# Altium schematic sheet SEP00755AG.SCHDOC
size A4
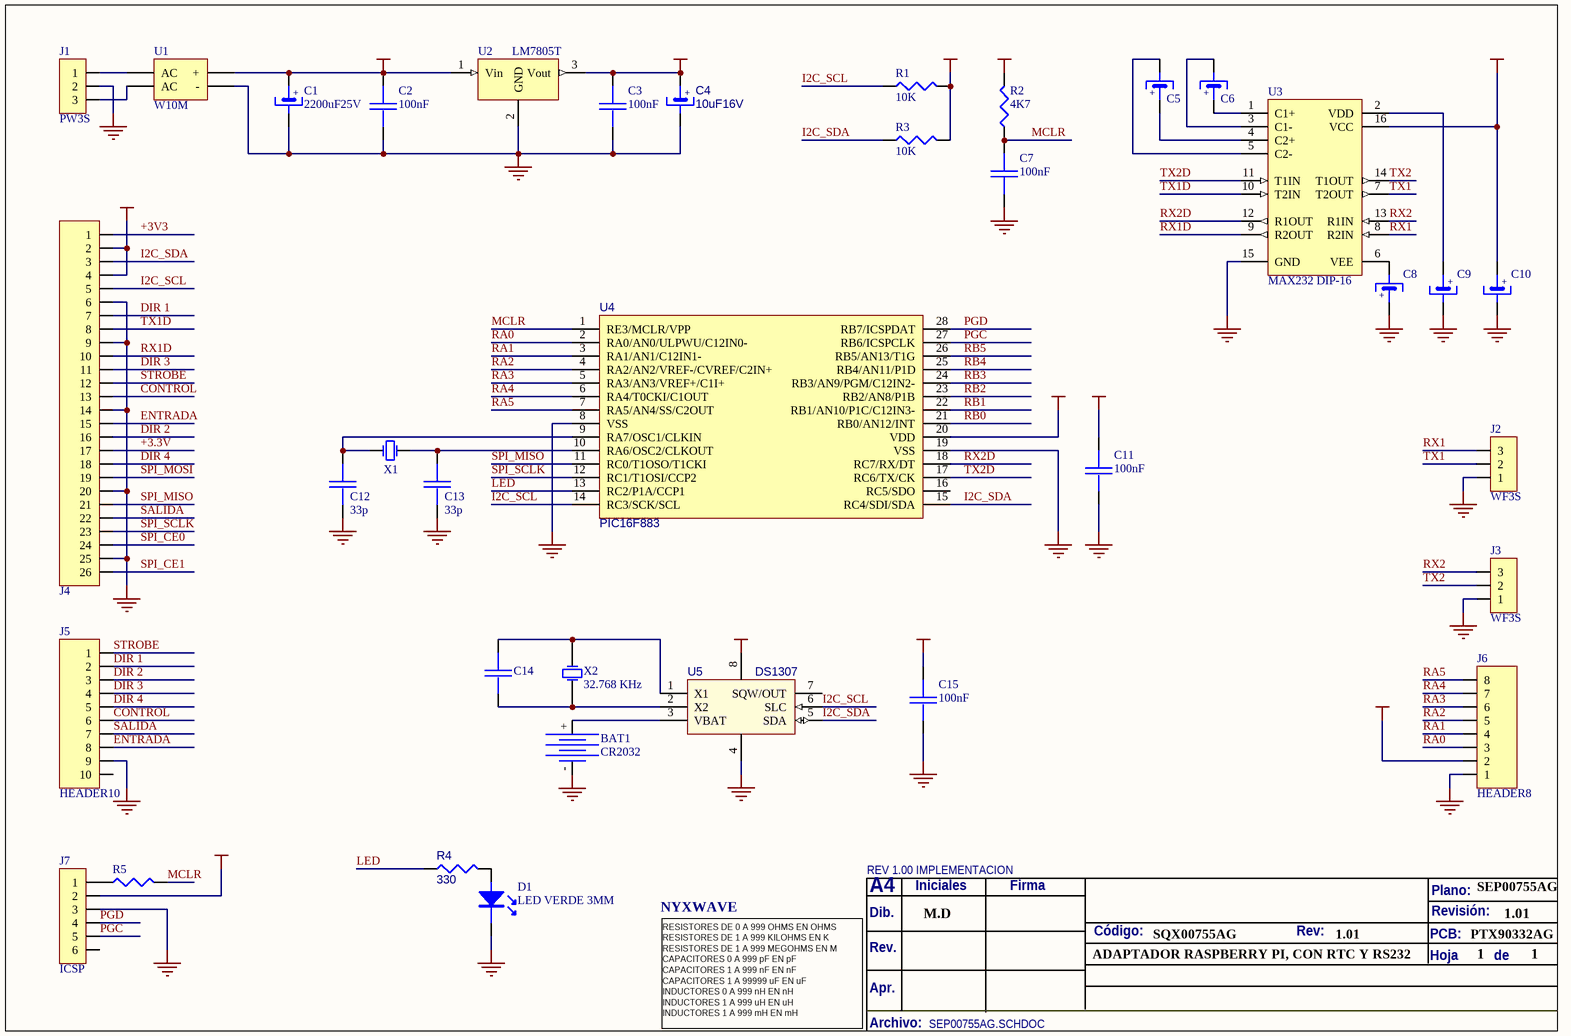
[diagram p0: SEP00755AG.SCHDOC]

## Parts
BAT1  CR2032  [CR2032 HOLDER]
C1  2200uF25V  [CE 7.5/16.0]
C2  100nF  [0805]
C3  100nF  [0805]
C4  10uF16V  [CE 2.5/5.0]
C5  10uF50V  [CE 2.5/5.0]  (value not drawn)
C6  10uF50V  [CE 2.5/5.0]  (value not drawn)
C7  100nF  [0805]
C8  10uF50V  [CE 2.5/5.0]  (value not drawn)
C9  10uF50V  [CE 2.5/5.0]  (value not drawn)
C10  10uF50V  [CE 2.5/5.0]  (value not drawn)
C11  100nF  [0805]
C12  33p  [CAP2.54]
C13  33p  [CAP2.54]
C14  15p  [CAP2.54]  (value not drawn)
C15  100nF  [0805]
D1  LED VERDE 3MM  [LED 3MM]
J1  PW3S  [PW3S]
J2  WF3S  [WF3S]
J3  WF3S  [WF3S]
J4  HEADER26  [IDC26]  (value not drawn)
J5  HEADER10  [IDC10]
J6  HEADER8  [IDC8]
J7  ICSP  [ICSP]
NYXWAVE  LOGO NYX  [LOGO_NYX]  (value not drawn)
R1  10K  [0805]
R2  4K7  [0805]
R3  10K  [0805]
R4  330  [0805]
R5  100  [0805]  (value not drawn)
U1  W10M  [CASE22]
U2  LM7805T  [TO-220_2]
U3  MAX232 DIP-16  [DIP16]
U4  PIC16F883  [SOIC 28]
U5  DS1307  [SO-8]
X1  XL20M-UM5  [UM5]  (value not drawn)
X2  32.768 KHz  [XTAL ACOSTADO]

## Nets
+5V: C3.2 C4.1 C10.1 C11.2 C15.2 J4.2 J4.4 J6.2 J7.2 R1.2 R2.2 R3.2 U2.3(Vout) U3.16(VCC) U4.20(VDD) U5.8(VCC)
GND: BAT1.- C1.2 C2.1 C3.1 C4.2 C7.2 C8.1 C9.2 C10.2 C11.1 C12.1 C13.1 C15.1 D1.K J1.2 J2.1 J3.1 J4.6 J4.9 J4.14 J4.20 J4.25 J5.9 J6.1 J7.3 U1.3(-) U2.2(GND) U3.15(GND) U4.8(VSS) U4.19(VSS) U5.4(VSS)
VCC: C1.1 C2.2 U1.1(+) U2.1(Vin)
+3.3V: J4.17
+3V3: J4.1
CONTROL: J4.13 J5.6
DIR 1: J4.7 J5.2
DIR 2: J4.16 J5.3
DIR 3: J4.11 J5.4
DIR 4: J4.18 J5.5
ENTRADA: J4.15 J5.8
I2C_SCL: J4.5 R1.1 U4.14(RC3/SCK/SCL) U5.6(SLC)
I2C_SDA: J4.3 R3.1 U4.15(RC4/SDI/SDA) U5.5(SDA)
LED: R4.1 U4.13(RC2/P1A/CCP1)
MCLR: C7.1 R2.1 R5.1 U4.1(RE3/MCLR/VPP)
PGC: J7.5 U4.27(RB6/ICSPCLK)
PGD: J7.4 U4.28(RB7/ICSPDAT)
RA0: J6.3 U4.2(RA0/AN0/ULPWU/C12IN0-)
RA1: J6.4 U4.3(RA1/AN1/C12IN1-)
RA2: J6.5 U4.4(RA2/AN2/VREF-/CVREF/C2IN+)
RA3: J6.6 U4.5(RA3/AN3/VREF+/C1I+)
RA4: J6.7 U4.6(RA4/T0CKI/C1OUT)
RA5: J6.8 U4.7(RA5/AN4/SS/C2OUT)
RB0: U4.21(RB0/AN12/INT)
RB1: U4.22(RB1/AN10/P1C/C12IN3-)
RB2: U4.23(RB2/AN8/P1B)
RB3: U4.24(RB3/AN9/PGM/C12IN2-)
RB4: U4.25(RB4/AN11/P1D)
RB5: U4.26(RB5/AN13/T1G)
RX1: J2.3 U3.8(R2IN)
RX1D: J4.10 U3.9(R2OUT)
RX2: J3.3 U3.13(R1IN)
RX2D: U3.12(R1OUT) U4.18(RC7/RX/DT)
SALIDA: J4.22 J5.7
SPI_CE0: J4.24
SPI_CE1: J4.26
SPI_MISO: J4.21 U4.11(RC0/T1OSO/T1CKI)
SPI_MOSI: J4.19
SPI_SCLK: J4.23 U4.12(RC1/T1OSI/CCP2)
STROBE: J4.12 J5.1
TX1: J2.2 U3.7(T2OUT)
TX1D: J4.8 U3.10(T2IN)
TX2: J3.2 U3.14(T1OUT)
TX2D: U3.11(T1IN) U4.17(RC6/TX/CK)
NetBAT1_+: BAT1.+ U5.3(VBAT)
NetC5_1: C5.1 U3.4(C2+)
NetC5_2: C5.2 U3.5(C2-)
NetC6_1: C6.1 U3.1(C1+)
NetC6_2: C6.2 U3.3(C1-)
NetC8_2: C8.2 U3.6(VEE)
NetC9_1: C9.1 U3.2(VDD)
NetC12_2: C12.2 U4.9(RA7/OSC1/CLKIN) X1.1(OSC1)
NetC13_2: C13.2 U4.10(RA6/OSC2/CLKOUT) X1.2(OSC2)
NetC14_1: C14.1 U5.2(X2) X2.1(OSC1)
NetC14_2: C14.2 U5.1(X1) X2.2(OSC2)
NetD1_A: D1.A R4.2
NetJ1_1: J1.1 U1.2(AC)
NetJ1_3: J1.3 U1.4(AC)
NetJ7_1: J7.1 R5.2

Not connected (* = marked no-connect by the designer): J5 10; J7 6; U4 16(RC5/SDO); U5 7(SQW/OUT)

## Notes on the sheet
- M.D
- SEP00755AG
- 1.01
- ADAPTADOR RASPBERRY PI, CON RTC Y RS232
- SQX00755AG
- PTX90332AG
- 1
- REV 1.00 IMPLEMENTACION
- Dib.
- A4
- Iniciales
- Firma
- Plano:
- Revisión:
- Rev.
- Código:
- Rev:
- Hoja          de
- PCB:
- RESISTORES DE 0 A 999 OHMS EN OHMS
  RESISTORES DE 1 A 999 KILOHMS EN K
  RESISTORES DE 1 A 999 MEGOHMS EN M
  CAPACITORES 0 A 999 pF EN pF
  CAPACITORES 1 A 999 nF EN nF
  CAPACITORES 1 A 99999 uF EN uF
  INDUCTORES 0 A 999 nH EN nH
  INDUCTORES 1 A 999 uH EN uH
  INDUCTORES 1 A 999 mH EN mH
- Apr.
- Archivo:
- (in symbol 10uF16V) +
- (in symbol 10uF50V) +
- (in symbol 2200uF25V) +

## Library data of the parts
BAT1 = CR2032 HOLDER: CR2032 BATTERY HOLDER; CODIGO: JZ0000001G
C1 = 2200uF25V: CAPACITOR ELECTROLITICO RADIAL 16X25 mm PASO 7.5 mm +/-20% 85ºC 25V 2200uF; CODIGO: YEAS228EBG
C2 C3 C7 C11 C15 = 100n: CAPACITOR SMD 0805 X7R  50 V 100 nF; CODIGO: YSBC104AAG
C4 = 10uF16V: CAPACITOR ELECTROLITICO RADIAL 5X11mm PASO 2mm 85ªC +/-20 16V 10uF; CODIGO: YEAF106DBG
C5 C6 C8-C10 = 10uF50V: CAPACITOR ELECTROLITICO RADIAL 5 X11mm PASO 2 mm 85ºC +/-20% 50 V 10 uF; CODIGO: YEAF106GBG
C12 C13 = 33p: CAPACITOR PLATE NP0 100V PASO 2.54 mm 33 pF; CODIGO: YPA0330BAG
C14 = 15p: CAPACITOR CERAMICO DISCO 2.54 mm  X7R  50V  15pF; CODIGO: YCAC150AAG
D1 = LED VERDE 3MM: CODIGO: DLRV030XCG
J1 = PW3S: PW3S HEADER .156" RECTO 3 VIAS; CODIGO: JNXEISP03G
J2 J3 = WF3S: WF3S HEADER .100" RECTO 3 VIAS; CODIGO: JCXGASP03G
J4 = HEADER26: CONECTOR IDC MACHO PCB NO POLARIZADO PASO 2.54 mm RECTO 2X13 VIAS; CODIGO: JNXJCSP26G
J5 = HEADER10: CONECTOR IDC MACHO PCB NO POLARIZADO PASO 2.54 mm RECTO 2X5 VIAS; CODIGO: JNXJCSP10G
J6 = HEADER8: CONECTOR IDC MACHO PCB NO POLARIZADO PASO 2.54 mm RECTO 2X4 VIAS; CODIGO: JNXJCSP08G
J7 = ICSP: TIRA MOLEX 1X6 11MM MACHO RECTA PARA PCB
NYXWAVE = LOGO NYXWAVE: LOGO DE NYXWAVE
R1 R3 = 10K: RESISTOR SMD0805 0.125 W 5%  10 K OHMS; CODIGO: RSB00103EG
R2 = 4K7: RESISTOR SMD0805 0.125 W 5%  4.7 K OHMS; CODIGO: RSB00472EG
R4 = 330: RESISTOR SMD0805 0.125 W 5%  330 OHMS; CODIGO: RSB00331EG
R5 = 100: RESISTOR SMD0805 0.125 W 5%  100 OHMS; CODIGO: RSB00101EG
U1 = W10M: W10M CASE22 CIRC INT RECTIFICADOR PUENTE 1000V 1A; CODIGO: UU00004HAH
U2 = LM7805T: LM7805T TO-220 CIRC INT; CODIGO: UV00001EBG
U3 = MAX232 DIP-16: MAX232 DIP-16 CIRCUITO INTEGRADO; CODIGO: UZ00013AGH
U4 = PIC16F883 SOIC28: PIC16F8883 -I/SO SOIC 28 PINES; CODIGO: UI00013ACH
U5 = DS1307: DS1307 SOIC8 CIRCUITO INTEGRADO; CODIGO: UD0000058G
X1 = XL20M-UM5: XL20M-UM5 CRISTAL DE 20 MHZ 10ppm; CODIGO: XXAC00012H
X2 = 32.768 KHz: 32.768 KHz CRISTAL CILINDRICO; CODIGO: XXAD00001H